# EAGLE design flashlight-boost (EAGLE 7.0.0)
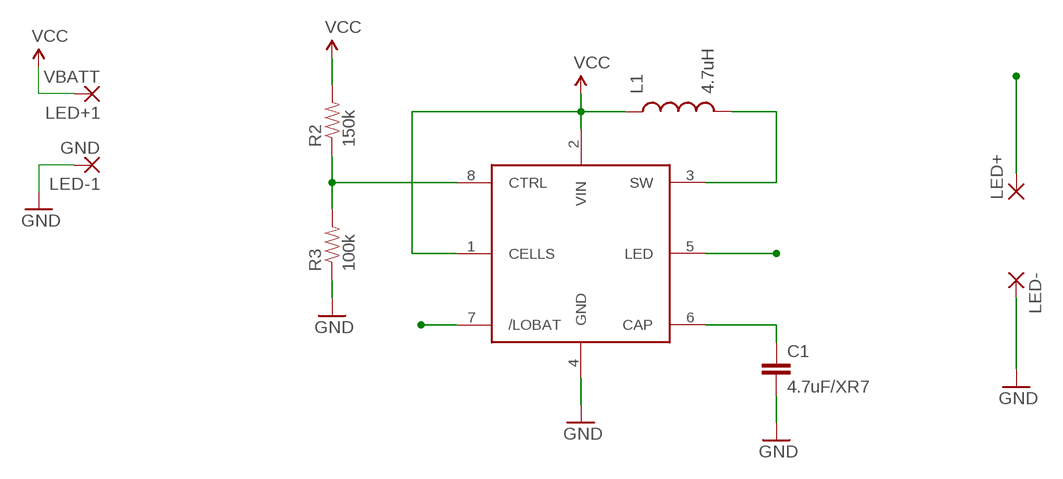
[diagram p0: schematic, sheet 1]

## Parts
C1  4.7uF/XR7  CAP1206  [1206]
L1  4.7uH  INDUCTOR1210  [1210]
LED+  2,54/1,0  [2,54/1,0]
LED+1  VBATT  2,54/1,0  [2,54/1,0]
LED-  2,54/1,0  [2,54/1,0]
LED-1  GND  2,54/1,0  [2,54/1,0]
R2  150k  RESISTOR0603-RES  [0603-RES]
R3  100k  RESISTOR0603-RES  [0603-RES]
U$1  LTC3490NSOIC-8  [NSOIC-8]

## Nets
GND: C1.2 LED-1.1(P) LED-.1(P) R3.1 U$1.4(GND)
LED: LED+.1(P) U$1.5(LED)
N$4: L1.2 U$1.3(SW)
N$5: C1.1 U$1.6(CAP)
N$6: U$1.7(/LOBAT)
N$10: R2.1 R3.2 U$1.8(CTRL)
VCC: L1.1 LED+1.1(P) R2.2 U$1.1(CELLS) U$1.2(VIN)

## Library data of the parts
C1 = SparkFun-Passives:CAP: Capacitor Standard 0603 ceramic capacitor, and 0.1" leaded capacitor.
L1 = SparkFun-Passives:INDUCTOR: Inductors Basic Inductor/Choke - 0603 and 1206. Footprints are not proven and vary greatly between part numbers.
LED+ LED+1 LED- LED-1 = wirepad:2,54/1,0: THROUGH-HOLE PAD
R2 R3 = SparkFun-Resistors:RESISTOR: Resistor Basic schematic elements and footprints for 0603, 1206, and PTH resistors.
U$1 = Synapseware:LTC3490

## Board
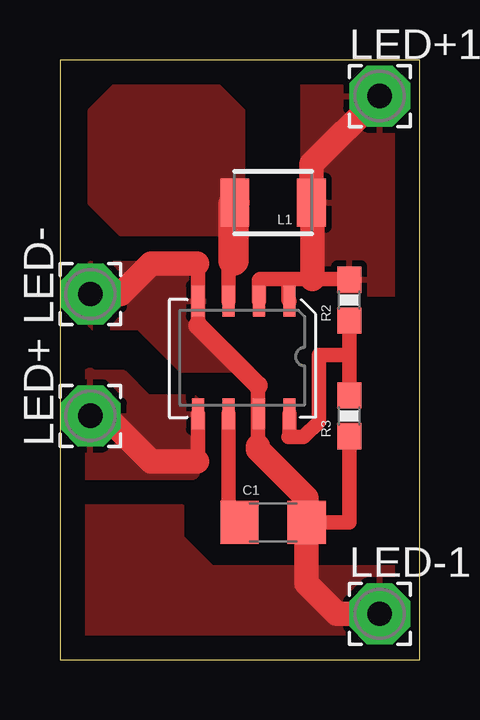
[diagram p1: board, top side]

Size 15 x 25 mm. Coordinates in mm from the lower left corner, seen from the top.
Outline: 0,0 15,0 15,25 0,25 0,0
Copper layers (1*16): Top 0.035mm / dielectric 1.5mm / Bottom 0.035mm
Design rules "default": minimum track width 10mil, minimum drill 24mil, track to track 8mil, track to pad 8mil, pad to pad 8mil, via to via 8mil, smd to smd 8mil, copper to edge 40mil, drill to drill 8mil, minimum pad ring 10mil, minimum via ring 8mil, stop-mask expansion 4mil, vias tented up to drill 0mil, thermal gap 10mil

### Footprints (pad centres in the part's own frame; a part is rotated, then mirrored left to right if it is on the bottom)
1206 = smd 1.6 x 1.8: 1 -1.4,0; 2 1.4,0
1210 = smd 1.2 x 2: 1 -1.6,0; 2 1.6,0
2,54/1,0 = drill 1.016 pad 2.54 octagon: 1 0,0
0603-RES = smd 1.1 x 1: 1 -0.85,0; 2 0.85,0
NSOIC-8 = smd 0.508 x 1.27: 1 -1.951,-2.24; 2 -0.681,-2.24; 3 0.589,-2.24; 4 1.859,-2.24; 5 1.859,2.459; 6 0.589,2.459; 7 -0.681,2.459; 8 -1.951,2.459

### Placement (x,y rotation side)
C1  8.89,5.71 0 top
L1  8.89,19.05 180 top
LED+  1.27,10.16 90 top
LED+1  13.34,23.5 0 top
LED-  1.27,15.24 90 top
LED-1  13.34,1.91 0 top
R2  12.06,14.99 90 top
R3  12.06,10.16 90 top
U$1  7.62,12.7 180 top

### Tracks (layer width: path | path; a pad name or v marks a point on that pad's centre or on a via)
GND
  Top 0.61: 5.71,16.51 5.76,16.46 U$1.4 5.76,13.92 | 8.26,11.43 8.26,8.89 | 10.79,5.84 C1.2 12.06,5.71 R3.1
  Top 0.813: 5.76,13.92 8.26,11.43
  Top 1.016: LED-.1 2.54,15.24 3.81,16.51 5.71,16.51 | LED-1.1 11.56,1.91 10.29,3.17 C1.2 10.29,6.73 8.26,8.76 8.26,8.89
  pour Top: 14.99,3.81 6.35,3.81 5.08,5.08 5.08,6.35 0,6.35 0,0 14.99,0
  pour Top: 1.27,16.51 4.7,16.51 5.97,15.24 5.97,14.1 8,12.06 5.08,12.06 3.3,13.84 1.4,13.84 1.27,13.97
LED
  Top 0.61: U$1.5 5.76,8.3 5.71,8.26
  Top 1.016: LED+.1 1.91,10.16 3.81,8.26 5.71,8.26
  pour Top: 0,11.43 0,7.62 5.59,7.62 5.71,7.75 5.71,10.79 5.59,10.92 3.68,10.92 2.67,11.94 1.4,11.94 1.27,12.06
N$4
  Top 0.61: U$1.3 7.03,16.43 7.24,16.64
  Top 1.27: 7.24,16.64 7.24,19 L1.2
  pour Top (no thermals): 7.62,17.78 7.62,22.86 6.35,24.13 2.54,24.13 1.27,22.86 1.27,19.05 2.54,17.78
N$5
  Top 0.61: U$1.6 7.03,5.92 7.62,5.97 C1.1
N$10
  Top 0.61: R2.1 12.06,12.7 | 12.06,12.7 R3.2 | U$1.8 9.57,9.32 9.53,9.27 10.16,9.27 10.79,9.91 10.79,12.7 12.06,12.7
VCC
  Top 0.61: U$1.2 8.3,15.83 8.35,15.88 9.53,15.88 | 9.53,15.88 9.53,14.99 U$1.1 | L1.1 10.54,18.67 | R2.2 12.06,15.88 10.54,15.88 9.53,15.88
  Top 1.016: 10.54,18.67 10.54,15.88 | L1.1 10.49,20.65 LED+1.1
  pour Top: 14.99,24.89 14.99,15.24 12.7,15.24 12.7,16.51 10.16,16.51 10.16,24.89